# Altium schematic sheet Main.SchDoc
size A4; SheetNumber: 1; SheetTotal: 4
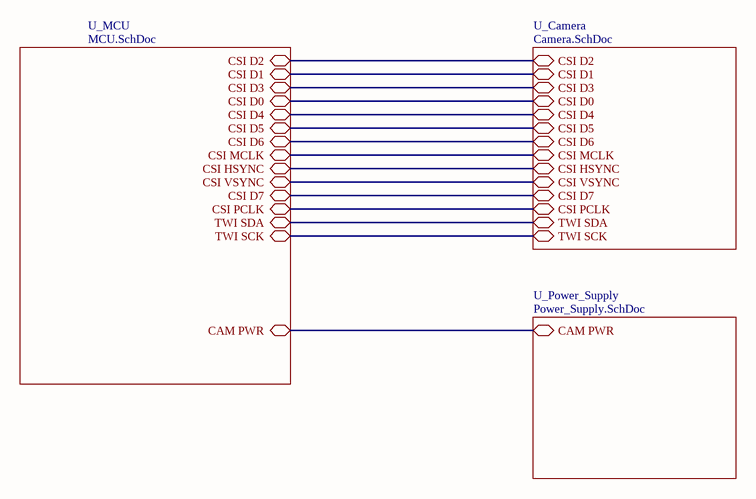
[diagram p0: Main.SchDoc]

## Sub-sheets
U_Camera = Camera.SchDoc: CSI D2 (bidir), CSI D1 (bidir), CSI D3 (bidir), CSI D0 (bidir), CSI D4 (bidir), CSI D5 (bidir), CSI D6 (bidir), CSI MCLK (bidir), CSI HSYNC (bidir), CSI VSYNC (bidir), CSI D7 (bidir), CSI PCLK (bidir), TWI SDA (bidir), TWI SCK (bidir)
U_MCU = MCU.SchDoc: CSI D5 (bidir), CSI D4 (bidir), CSI D1 (bidir), CSI D2 (bidir), CSI D3 (bidir), CSI PCLK (bidir), CSI HSYNC (bidir), CSI VSYNC (bidir), CSI D7 (bidir), CSI D6 (bidir), CAM PWR (bidir), CSI MCLK (bidir), CSI D0 (bidir), TWI SDA (bidir), TWI SCK (bidir)
U_Power_Supply = Power_Supply.SchDoc: CAM PWR (bidir)

## Nets
(unnamed): sheet U_Camera/CSI D2, sheet U_MCU/CSI D2
(unnamed): sheet U_Camera/CSI D1, sheet U_MCU/CSI D1
(unnamed): sheet U_Camera/CSI D3, sheet U_MCU/CSI D3
(unnamed): sheet U_Camera/CSI D0, sheet U_MCU/CSI D0
(unnamed): sheet U_Camera/CSI D4, sheet U_MCU/CSI D4
(unnamed): sheet U_Camera/CSI D5, sheet U_MCU/CSI D5
(unnamed): sheet U_Camera/CSI D6, sheet U_MCU/CSI D6
(unnamed): sheet U_Camera/CSI MCLK, sheet U_MCU/CSI MCLK
(unnamed): sheet U_Camera/CSI HSYNC, sheet U_MCU/CSI HSYNC
(unnamed): sheet U_Camera/CSI VSYNC, sheet U_MCU/CSI VSYNC
(unnamed): sheet U_Camera/CSI D7, sheet U_MCU/CSI D7
(unnamed): sheet U_Camera/CSI PCLK, sheet U_MCU/CSI PCLK
(unnamed): sheet U_Camera/TWI SDA, sheet U_MCU/TWI SDA
(unnamed): sheet U_Camera/TWI SCK, sheet U_MCU/TWI SCK
(unnamed): sheet U_Power_Supply/CAM PWR, sheet U_MCU/CAM PWR